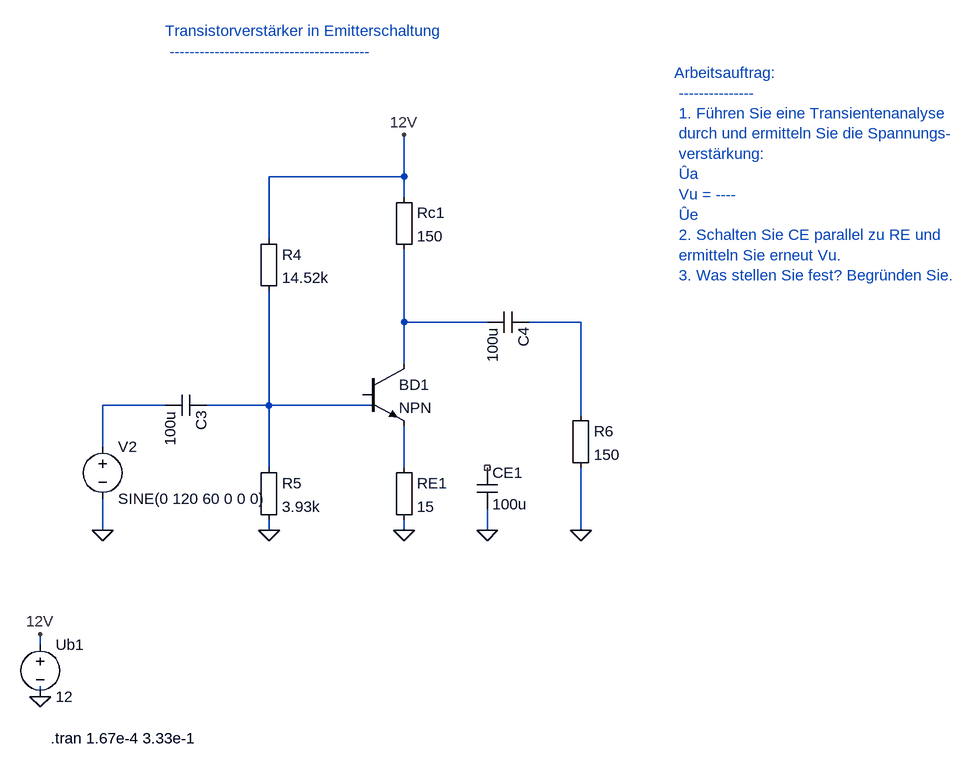
[diagram p0: schematic 9_1_4_Emitterschaltung.asc]
9_1_4_Emitterschaltung.asc, the LTspice schematic file:
Version 4
SHEET 1 880 680
WIRE 48 1072 48 1056
WIRE 544 608 560 608
WIRE 560 608 560 624
WIRE 608 656 608 688
WIRE 144 768 144 784
WIRE 240 624 224 624
WIRE 736 496 720 496
WIRE 736 784 736 800
WIRE 48 992 48 976
WIRE 608 304 608 272
WIRE 608 384 608 496
WIRE 608 272 608 208
WIRE 400 368 400 272
WIRE 400 272 608 272
WIRE 400 624 560 624
WIRE 400 448 400 624
WIRE 400 720 400 624
WIRE 400 816 400 800
WIRE 608 496 608 560
WIRE 880 640 880 496
WIRE 880 496 800 496
WIRE 144 688 144 624
WIRE 144 624 224 624
WIRE 608 800 608 816
WIRE 144 816 144 784
WIRE 304 624 400 624
WIRE 720 496 608 496
WIRE 880 816 880 720
WIRE 736 816 736 800
WIRE 608 688 608 720
FLAG 608 816 0
FLAG 48 1072 0
FLAG 400 816 0
FLAG 144 816 0
FLAG 880 816 0
FLAG 736 816 0
FLAG 608 816 0
FLAG 48 1072 0
FLAG 400 816 0
FLAG 144 816 0
FLAG 880 816 0
FLAG 736 816 0
FLAG 608 208 12V
FLAG 48 976 12V
SYMBOL voltage 48 976 R0
SYMATTR InstName Ub1
SYMATTR Value 12
SYMBOL npn 544 560 R0
SYMATTR InstName BD1
SYMATTR Value NPN
SYMBOL Misc\EuropeanResistor 384 352 R0
SYMATTR InstName R4
SYMATTR Value 14.52k
SYMBOL Misc\EuropeanResistor 592 288 R0
SYMATTR InstName Rc1
SYMATTR Value 150
SYMBOL Misc\EuropeanResistor 384 704 R0
SYMATTR InstName R5
SYMATTR Value 3.93k
SYMBOL Misc\EuropeanResistor 592 704 R0
SYMATTR InstName RE1
SYMATTR Value 15
SYMBOL voltage 144 672 R0
SYMATTR InstName V2
SYMATTR Value SINE(0 120 60 0 0 0)
SYMBOL cap 304 608 R90
SYMATTR InstName C3
SYMATTR Value 100u
SYMBOL cap 800 480 R90
SYMATTR InstName C4
SYMATTR Value 100u
SYMBOL Misc\EuropeanResistor 864 624 R0
SYMATTR InstName R6
SYMATTR Value 150
SYMBOL cap 720 720 R0
SYMATTR InstName CE1
SYMATTR Value 100u
TEXT 64 1136 Left 2 !.tran 1.67e-4 3.33e-1
TEXT 240 48 Left 2 ;Transistorverstärker in Emitterschaltung \n ----------------------------------------
TEXT 1024 112 Left 2 ;Arbeitsauftrag: \n --------------- \n 1. Führen Sie eine Transientenanalyse \n durch und ermitteln Sie die Spannungs- \n verstärkung: \n Ûa \n Vu = ---- \n Ûe \n 2. Schalten Sie CE parallel zu RE und \n ermitteln Sie erneut Vu. \n 3. Was stellen Sie fest? Begründen Sie.

The netlist it stands for:
* 9_1_4_Emitterschaltung.asc
V§Ub1 12V 0 12
Q§BD1 N004 N001 N002 0 NPN
R4 12V N001 14.52k
Rc1 12V N004 150
R5 N001 0 3.93k
RE1 N002 0 15
V2 N003 0 SINE(0 120 60 0 0 0)
C3 N001 N003 100u
C4 N005 N004 100u
R6 N005 0 150
CE1 NC_01 0 100u
.model NPN NPN
.model PNP PNP
.lib standard.bjt
.tran 1.67e-4 3.33e-1
* Transistorverstärker in Emitterschaltung
*  ----------------------------------------
* Arbeitsauftrag:
*  ---------------
*  1. Führen Sie eine Transientenanalyse
*  durch und ermitteln Sie die Spannungs-
*  verstärkung:
*  Ûa
*  Vu = ----
*  Ûe
*  2. Schalten Sie CE parallel zu RE und
*  ermitteln Sie erneut Vu.
*  3. Was stellen Sie fest? Begründen Sie.
.backanno
.end